# Altium schematic sheet load cell amp.SchDoc
size 203 x 114 mm
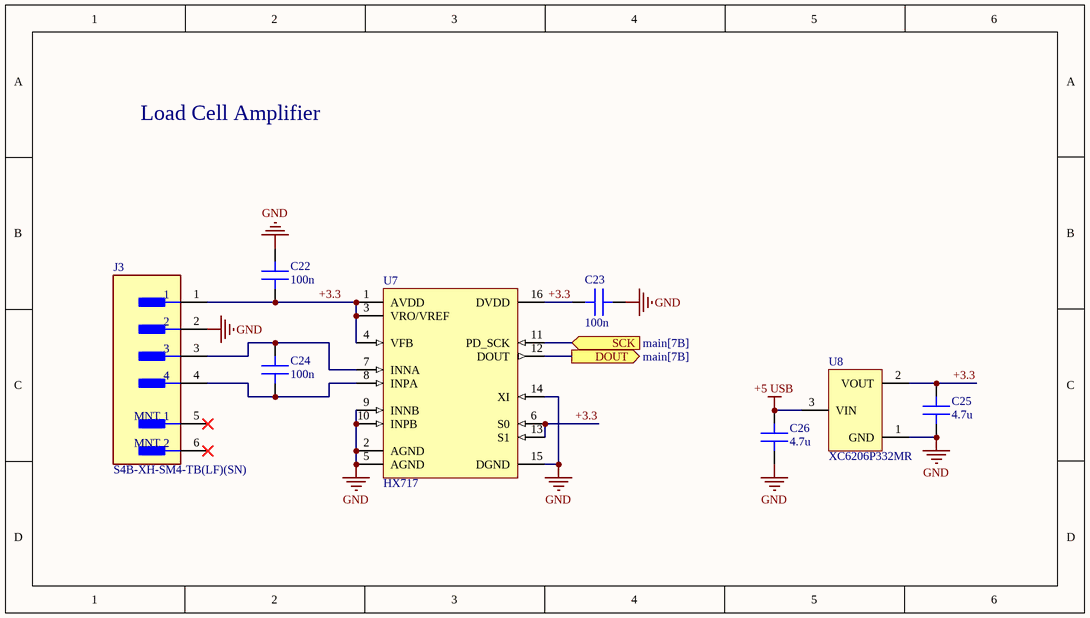
[diagram p0: load cell amp.SchDoc]

## Parts
C22  100n  [IPC C C0402 NO SILK]
C23  100n  [IPC C C0402 NO SILK]
C24  100n  [IPC C C0402 NO SILK]
C25  4.7u  [IPC C C0603 NO SILK]
C26  4.7u  [IPC C C0603 NO SILK]
J3  S4B-XH-SM4-TB(LF)(SN)  [FP-S4B-XH-SM4-TB_LF_SN-MFG]
U7  HX717  [SOIC127P600X160-16L]
U8  XC6206P332MR  [SOT23-3]

## Ports
DOUT (out, see main[7B]), SCK (in, see main[7B])

## Nets
+5 USB: C26.2 U8.3(VIN)
GND: C22.2 C23.1 C25.1 C26.1 J3.2 U7.2(AGND) U7.5(AGND) U7.9(INNB) U7.10(INPB) U7.14(XI) U7.15(DGND) U8.1(GND)
+3.3: C22.1 C23.2 C25.2 J3.1 U7.1(AVDD) U7.3(VRO/VREF) U7.4(VFB) U7.6(S0) U7.13(S1) U7.16(DVDD) U8.2(VOUT)
DOUT: U7.12(DOUT) ; port DOUT
SCK: U7.11(PD_SCK) ; port SCK
NetC24_1: C24.1 J3.4 U7.8(INPA)
NetC24_2: C24.2 J3.3 U7.7(INNA)

Not connected (* = marked no-connect by the designer): J3 5(MNT_1)* 6(MNT_2)*

## Notes on the sheet
- Load Cell Amplifier

## Library data of the parts
C22-C24 = Generic CAP 0402: Value: 100n
C25 C26 = Generic CAP 0603: Value: 4.7u
J3 = CMP-17439-000072-1: CONN HEADER SMD R/A 4POS 2.5MM; Number of Positions: 4; Max Current Rating: 3A; Max Voltage Rating (AC): 250V; Connector Type: Male Pin; Contact Resistance: 20mR; Gender: Male; Pitch: 0.098inch; Max Operating Temperature: 85°C; Contact Plating: Tin; Housing Material: Polyamide; Housing Color: Beige; Depth: 10mm; Series: XH; Package Quantity: 1; Length: 15mm; Contact Material: Copper Alloy; Min Operating Temperature: -25°C; REACH SVHC: No SVHC; Orientation: Right Angle; Number of Rows: 1; Contact Type: Male Pin; Color: Natural; Lead Free: Lead Free; Termination: Solder; Mount: Surface Mount; Number of Contacts: 4; Packaging: Tape and Reel
U8 = 3.3V Regulator XC6206P332MR_C5446: Output Type: Output Polarity:Positive Number of Outputs:1 Maximum Input Voltage:6V Output Voltage:3.3V~3.3V Output Voltage:3.3V~3.3V Dropout Voltage:680mV@(100mA) Output Current:200mA Power Supply Rejection Ratio (PSRR):-; Manufacturer: TOREX(特瑞仕); Add into BOM: yes; Number of Outputs: 1; Maximum Input Voltage: 6V; Output Current: 200mA; Symbol: XC6206P332MR; Device: XC6206P332MR_C5446; LCSC Part Name: 正 Vin=6V Vout=3.3V 200mA; Supplier Part: C5446; Manufacturer Part: XC6206P332MR; Supplier Footprint: SOT-23-3L; JLCPCB Part Class: Basic Part; Datasheet: https://atta.szlcsc.com/upload/public/pdf/source/20130801/1457706628791.pdf; Supplier: LCSC; Convert to PCB: yes; Output Polarity: Positive; Output Voltage: 3.3V~3.3V; Dropout Voltage: 680mV@(100mA); Power Supply Rejection Ratio (PSRR): -